# Altium schematic sheet HTBBMSALL4G.SchDoc
size 594 x 420 mm; SheetNumber: 1; SheetTotal: 1
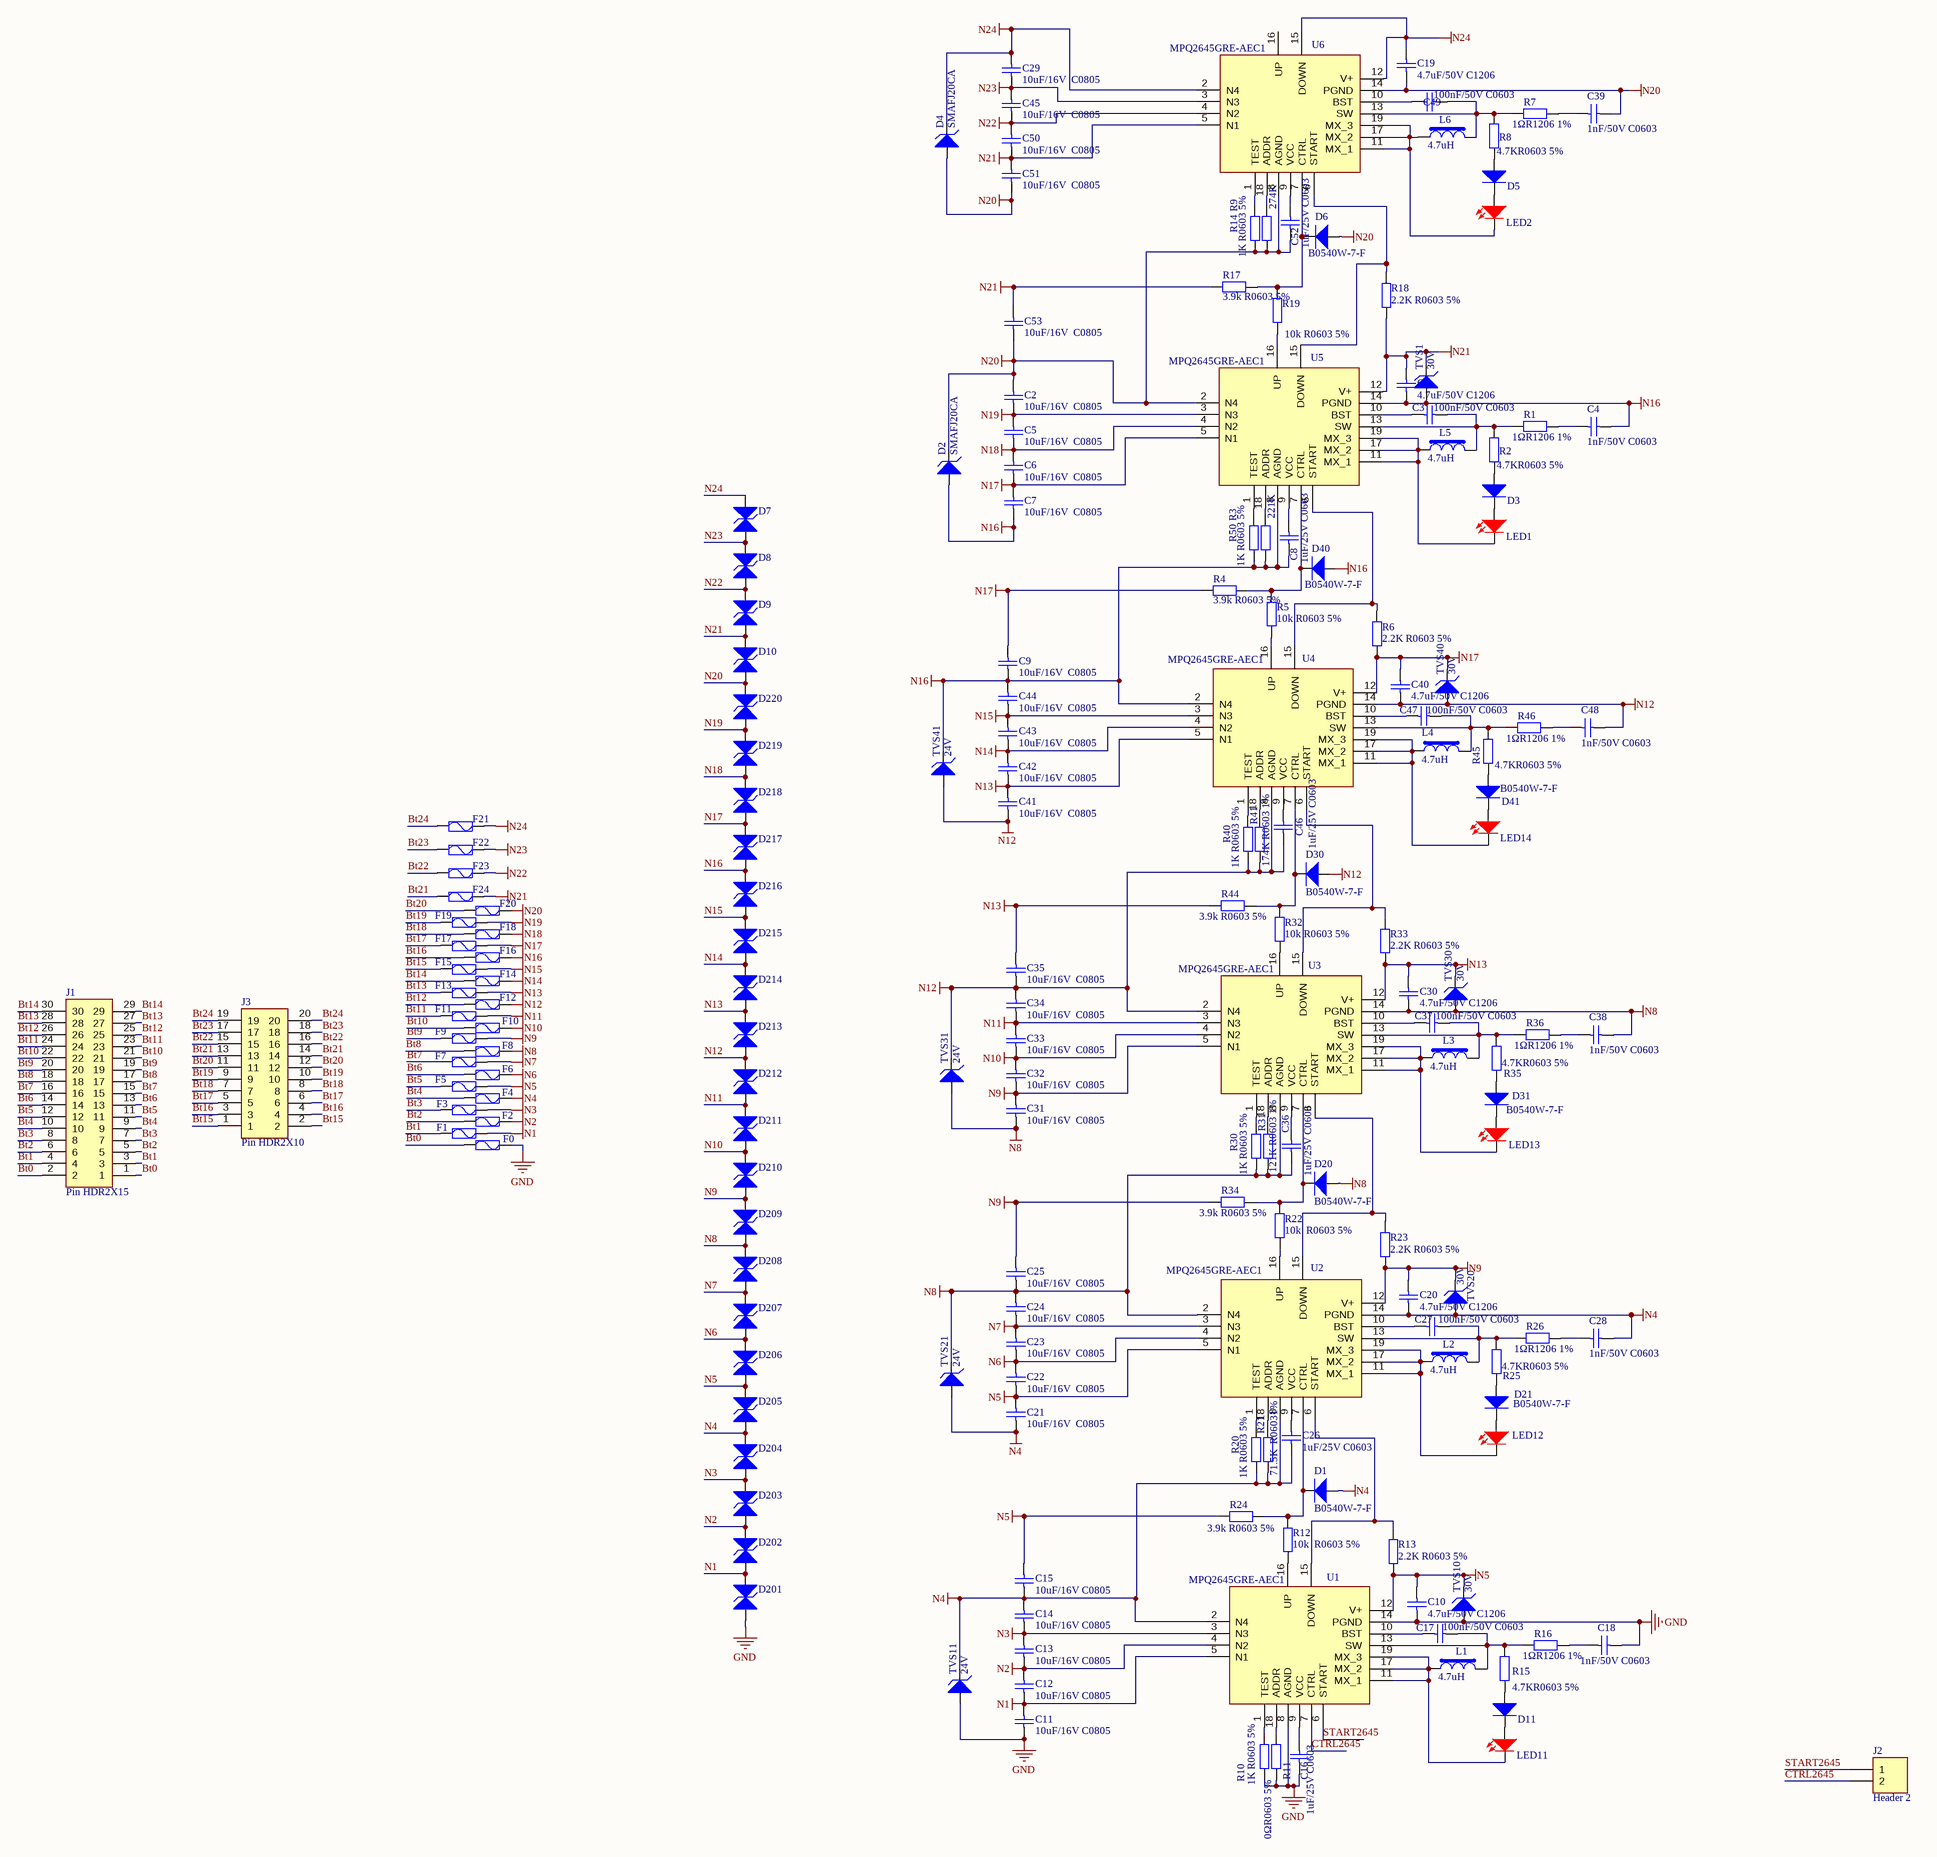
[diagram p0: HTBBMSALL4G.SchDoc]

## Parts
C1  4.7uF/50V C1206  [C1206]
C2  10uF/16V  C0805  [C0805]
C3  100nF/50V C0603  [C0603]
C4  1nF/50V C0603  [C0603]
C5  10uF/16V  C0805  [C0805]
C6  10uF/16V  C0805  [C0805]
C7  10uF/16V  C0805  [C0805]
C8  1uF/25V C0603  [C0603]
C9  10uF/16V  C0805  [C0805]
C10  4.7uF/50V C1206  [C1206]
C11  10uF/16V C0805  [C0805]
C12  10uF/16V C0805  [C0805]
C13  10uF/16V C0805  [C0805]
C14  10uF/16V C0805  [C0805]
C15  10uF/16V C0805  [C0805]
C16  1uF/25V C0603  [C0603]
C17  100nF/50V C0603  [C0603]
C18  1nF/50V C0603  [C0603]
C19  4.7uF/50V C1206  [C1206]
C20  4.7uF/50V C1206  [C1206]
C21  10uF/16V  C0805  [C0805]
C22  10uF/16V  C0805  [C0805]
C23  10uF/16V  C0805  [C0805]
C24  10uF/16V  C0805  [C0805]
C25  10uF/16V  C0805  [C0805]
C26  1uF/25V C0603  [C0603]
C27  100nF/50V C0603  [C0603]
C28  1nF/50V C0603  [C0603]
C29  10uF/16V  C0805  [C0805]
C30  4.7uF/50V C1206  [C1206]
C31  10uF/16V  C0805  [C0805]
C32  10uF/16V  C0805  [C0805]
C33  10uF/16V  C0805  [C0805]
C34  10uF/16V  C0805  [C0805]
C35  10uF/16V  C0805  [C0805]
C36  1uF/25V C0603  [C0603]
C37  100nF/50V C0603  [C0603]
C38  1nF/50V C0603  [C0603]
C39  1nF/50V C0603  [C0603]
C40  4.7uF/50V C1206  [C1206]
C41  10uF/16V  C0805  [C0805]
C42  10uF/16V  C0805  [C0805]
C43  10uF/16V  C0805  [C0805]
C44  10uF/16V  C0805  [C0805]
C45  10uF/16V  C0805  [C0805]
C46  1uF/25V C0603  [C0603]
C47  100nF/50V C0603  [C0603]
C48  1nF/50V C0603  [C0603]
C49  100nF/50V C0603  [C0603]
C50  10uF/16V  C0805  [C0805]
C51  10uF/16V  C0805  [C0805]
C52  1uF/25V C0603  [C0603]
C53  10uF/16V  C0805  [C0805]
D1  B0540W-7-F  [SOD-123FL]
D2  SMAFJ20CA  [SMAF/DO-214AD]
D3  B0540W-7-F  [SOD-123FL]  (value not drawn)
D4  SMAFJ20CA  [SMAF/DO-214AD]
D5  B0540W-7-F  [SOD-123FL]  (value not drawn)
D6  B0540W-7-F  [SOD-123FL]
D7  1N5819HW-7-F  [SOD-123FL]  (value not drawn)
D8  1N5819HW-7-F  [SOD-123FL]  (value not drawn)
D9  1N5819HW-7-F  [SOD-123FL]  (value not drawn)
D10  1N5819HW-7-F  [SOD-123FL]  (value not drawn)
D11  B0540W-7-F  [SOD-123FL]  (value not drawn)
D20  B0540W-7-F  [SOD-123FL]
D21  B0540W-7-F  [SOD-123FL]
D30  B0540W-7-F  [SOD-123FL]
D31  B0540W-7-F  [SOD-123FL]
D40  B0540W-7-F  [SOD-123FL]
D41  B0540W-7-F  [SOD-123FL]
D201  1N5819HW-7-F  [SOD-123FL]  (value not drawn)
D202  1N5819HW-7-F  [SOD-123FL]  (value not drawn)
D203  1N5819HW-7-F  [SOD-123FL]  (value not drawn)
D204  1N5819HW-7-F  [SOD-123FL]  (value not drawn)
D205  1N5819HW-7-F  [SOD-123FL]  (value not drawn)
D206  1N5819HW-7-F  [SOD-123FL]  (value not drawn)
D207  1N5819HW-7-F  [SOD-123FL]  (value not drawn)
D208  1N5819HW-7-F  [SOD-123FL]  (value not drawn)
D209  1N5819HW-7-F  [SOD-123FL]  (value not drawn)
D210  1N5819HW-7-F  [SOD-123FL]  (value not drawn)
D211  1N5819HW-7-F  [SOD-123FL]  (value not drawn)
D212  1N5819HW-7-F  [SOD-123FL]  (value not drawn)
D213  1N5819HW-7-F  [SOD-123FL]  (value not drawn)
D214  1N5819HW-7-F  [SOD-123FL]  (value not drawn)
D215  1N5819HW-7-F  [SOD-123FL]  (value not drawn)
D216  1N5819HW-7-F  [SOD-123FL]  (value not drawn)
D217  1N5819HW-7-F  [SOD-123FL]  (value not drawn)
D218  1N5819HW-7-F  [SOD-123FL]  (value not drawn)
D219  1N5819HW-7-F  [SOD-123FL]  (value not drawn)
D220  1N5819HW-7-F  [SOD-123FL]  (value not drawn)
F0  0458008.DR  [F1206]  (value not drawn)
F1  0458008.DR  [F1206]  (value not drawn)
F2  0458008.DR  [F1206]  (value not drawn)
F3  0458008.DR  [F1206]  (value not drawn)
F4  0458008.DR  [F1206]  (value not drawn)
F5  0458008.DR  [F1206]  (value not drawn)
F6  0458008.DR  [F1206]  (value not drawn)
F7  0458008.DR  [F1206]  (value not drawn)
F8  0458008.DR  [F1206]  (value not drawn)
F9  0458008.DR  [F1206]  (value not drawn)
F10  0458008.DR  [F1206]  (value not drawn)
F11  0458008.DR  [F1206]  (value not drawn)
F12  0458008.DR  [F1206]  (value not drawn)
F13  0458008.DR  [F1206]  (value not drawn)
F14  0458008.DR  [F1206]  (value not drawn)
F15  0458008.DR  [F1206]  (value not drawn)
F16  0458008.DR  [F1206]  (value not drawn)
F17  0458008.DR  [F1206]  (value not drawn)
F18  0458008.DR  [F1206]  (value not drawn)
F19  0458008.DR  [F1206]  (value not drawn)
F20  0458008.DR  [F1206]  (value not drawn)
F21  0458008.DR  [F1206]  (value not drawn)
F22  0458008.DR  [F1206]  (value not drawn)
F23  0458008.DR  [F1206]  (value not drawn)
F24  0458008.DR  [F1206]  (value not drawn)
J1  Pin HDR2X15  [PH2.0-15*2]
J2  Header 2  [HDR1X2]
J3  Pin HDR2X10  [PH2.0-10*2]
L1  4.7uH  [L7*6.6]
L2  4.7uH  [L7*6.6]
L3  4.7uH  [L7*6.6]
L4  4.7uH  [L7*6.6]
L5  4.7uH  [L7*6.6]
L6  4.7uH  [L7*6.6]
LED1  XL-1608SURC-06  [LED0603R]  (value not drawn)
LED2  XL-1608SURC-06  [LED0603R]  (value not drawn)
LED11  XL-1608SURC-06  [LED0603R]  (value not drawn)
LED12  XL-1608SURC-06  [LED0603R]  (value not drawn)
LED13  XL-1608SURC-06  [LED0603R]  (value not drawn)
LED14  XL-1608SURC-06  [LED0603R]  (value not drawn)
R1  1ΩR1206 1%  [1206]
R2  4.7KR0603 5%  [0603]
R3  221K  [0603]
R4  3.9k R0603 5%  [0603]
R5  10k R0603 5%  [0603]
R6  2.2K R0603 5%  [0603]
R7  1ΩR1206 1%  [1206]
R8  4.7KR0603 5%  [0603]
R9  274K  [0603]
R10  1K R0603 5%  [0603]
R11  0ΩR0603 5%  [0603]
R12  10k  R0603 5%  [0603]
R13  2.2K R0603 5%  [0603]
R14  1K R0603 5%  [0603]
R15  4.7KR0603 5%  [0603]
R16  1ΩR1206 1%  [1206]
R17  3.9k R0603 5%  [0603]
R18  2.2K R0603 5%  [0603]
R19  10k R0603 5%  [0603]
R20  1K R0603 5%  [0603]
R21  71.5K  R06031%  [0603]
R22  10k  R0603 5%  [0603]
R23  2.2K R0603 5%  [0603]
R24  3.9k R0603 5%  [0603]
R25  4.7KR0603 5%  [0603]
R26  1ΩR1206 1%  [1206]
R30  1K R0603 5%  [0603]
R31  121K R0603 1%  [0603]
R32  10k R0603 5%  [0603]
R33  2.2K R0603 5%  [0603]
R34  3.9k R0603 5%  [0603]
R35  4.7KR0603 5%  [0603]
R36  1ΩR1206 1%  [1206]
R40  1K R0603 5%  [0603]
R41  174K R0603 1%  [0603]
R44  3.9k R0603 5%  [0603]
R45  4.7KR0603 5%  [0603]
R46  1ΩR1206 1%  [1206]
R50  1K R0603 5%  [0603]
TVS1  30V  [SMAF/DO-214AD]
TVS10  30V  [SMAF/DO-214AD]
TVS11  24V  [SMAF/DO-214AD]
TVS20  30V  [SMAF/DO-214AD]
TVS21  24V  [SMAF/DO-214AD]
TVS30  30V  [SMAF/DO-214AD]
TVS31  24V  [SMAF/DO-214AD]
TVS40  30V  [SMAF/DO-214AD]
TVS41  24V  [SMAF/DO-214AD]
U1  MPQ2645GRE-AEC1  [QFN19_4x4]
U2  MPQ2645GRE-AEC1  [QFN19_4x4]
U3  MPQ2645GRE-AEC1  [QFN19_4x4]
U4  MPQ2645GRE-AEC1  [QFN19_4x4]
U5  MPQ2645GRE-AEC1  [QFN19_4x4]
U6  MPQ2645GRE-AEC1  [QFN19_4x4]

## Nets
GND: C10.1 C11.1 C16.1 C18.1 D201.1(A) F0.2 R10.2 R11.2 TVS10.1(A) TVS11.1(A) U1.8(AGND) U1.14(PGND)
N1: C11.2 C12.1 D201.2(K) D202.1(A) F1.2 U1.5(N1)
N2: C12.2 C13.1 D202.2(K) D203.1(A) F2.2 U1.4(N2)
N3: C13.2 C14.1 D203.2(K) D204.1(A) F3.2 U1.3(N3)
N4: C14.2 C15.1 C20.1 C21.1 C26.1 C28.1 D1.1(A) D204.2(K) D205.1(A) F4.2 R20.2 R21.2 TVS11.2(K) TVS20.1(A) TVS21.1(A) U1.2(N4) U2.8(AGND) U2.14(PGND)
N5: C10.2 C15.2 C21.2 C22.1 D205.2(K) D206.1(A) F5.2 R13.1 R24.2 TVS10.2(K) U1.12(V+) U2.5(N1)
N6: C22.2 C23.1 D206.2(K) D207.1(A) F6.2 U2.4(N2)
N7: C23.2 C24.1 D207.2(K) D208.1(A) F7.2 U2.3(N3)
N8: C24.2 C25.1 C30.1 C31.1 C36.1 C38.1 D20.1(A) D208.2(K) D209.1(A) F8.2 R30.2 R31.2 TVS21.2(K) TVS30.1(A) TVS31.1(A) U2.2(N4) U3.8(AGND) U3.14(PGND)
N9: C20.2 C25.2 C31.2 C32.1 D209.2(K) D210.1(A) F9.2 R23.1 R34.2 TVS20.2(K) U2.12(V+) U3.5(N1)
N10: C32.2 C33.1 D210.2(K) D211.1(A) F10.2 U3.4(N2)
N11: C33.2 C34.1 D211.2(K) D212.1(A) F11.2 U3.3(N3)
N12: C34.2 C35.1 C40.1 C41.1 C46.1 C48.1 D30.1(A) D212.2(K) D213.1(A) F12.2 R40.2 R41.2 TVS31.2(K) TVS40.1(A) TVS41.1(A) U3.2(N4) U4.8(AGND) U4.14(PGND)
N13: C30.2 C35.2 C41.2 C42.1 D213.2(K) D214.1(A) F13.2 R33.1 R44.2 TVS30.2(K) U3.12(V+) U4.5(N1)
N14: C42.2 C43.1 D214.2(K) D215.1(A) F14.2 U4.4(N2)
N15: C43.2 C44.1 D215.2(K) D216.1(A) F15.2 U4.3(N3)
N16: C1.1 C4.1 C7.1 C8.1 C9.1 C44.2 D2.1(A) D40.1(A) D216.2(K) D217.1(A) F16.2 R3.2 R50.2 TVS1.1(A) TVS41.2(K) U4.2(N4) U5.8(AGND) U5.14(PGND)
N17: C6.1 C7.2 C9.2 C40.2 D217.2(K) D218.1(A) F17.2 R4.2 R6.1 TVS40.2(K) U4.12(V+) U5.5(N1)
N18: C5.1 C6.2 D218.2(K) D219.1(A) F18.2 U5.4(N2)
N19: C2.1 C5.2 D219.2(K) D220.1(A) F19.2 U5.3(N3)
N20: C2.2 C19.1 C39.1 C51.1 C52.1 C53.1 D2.2(K) D4.1(A) D6.1(A) D10.1(A) D220.2(K) F20.2 R9.2 R14.2 U5.2(N4) U6.8(AGND) U6.14(PGND)
N21: C1.2 C50.1 C51.2 C53.2 D9.1(A) D10.2(K) F24.2 R17.2 R18.1 TVS1.2(K) U5.12(V+) U6.5(N1)
N22: C45.1 C50.2 D8.1(A) D9.2(K) F23.2 U6.4(N2)
N23: C29.1 C45.2 D7.1(A) D8.2(K) F22.2 U6.3(N3)
N24: C19.2 C29.2 D4.2(K) D7.2(K) F21.2 U6.2(N4) U6.12(V+) U6.15(DOWN)
Bt0: F0.1 J1.1 J1.2
Bt1: F1.1 J1.3 J1.4
Bt2: F2.1 J1.5 J1.6
Bt3: F3.1 J1.7 J1.8
Bt4: F4.1 J1.9 J1.10
Bt5: F5.1 J1.11 J1.12
Bt6: F6.1 J1.13 J1.14
Bt7: F7.1 J1.15 J1.16
Bt8: F8.1 J1.17 J1.18
Bt9: F9.1 J1.19 J1.20
Bt10: F10.1 J1.21 J1.22
Bt11: F11.1 J1.23 J1.24
Bt12: F12.1 J1.25 J1.26
Bt13: F13.1 J1.27 J1.28
Bt14: F14.1 J1.29 J1.30
Bt15: F15.1 J3.1 J3.2
Bt16: F16.1 J3.3 J3.4
Bt17: F17.1 J3.5 J3.6
Bt18: F18.1 J3.7 J3.8
Bt19: F19.1 J3.9 J3.10
Bt20: F20.1 J3.11 J3.12
Bt21: F24.1 J3.13 J3.14
Bt22: F23.1 J3.15 J3.16
Bt23: F22.1 J3.17 J3.18
Bt24: F21.1 J3.19 J3.20
CTRL2645: J2.2 U1.7(CTRL)
START2645: J2.1 U1.6(START)
NetC3_1: C3.1 L5.2 R1.2 R2.1 U5.13(SW)
NetC3_2: C3.2 U5.10(BST)
NetC4_2: C4.2 R1.1
NetC8_2: C8.2 U5.9(VCC)
NetC16_2: C16.2 U1.9(VCC)
NetC17_1: C17.1 L1.2 R15.1 R16.2 U1.13(SW)
NetC17_2: C17.2 U1.10(BST)
NetC18_2: C18.2 R16.1
NetC26_2: C26.2 U2.9(VCC)
NetC27_1: C27.1 L2.2 R25.1 R26.2 U2.13(SW)
NetC27_2: C27.2 U2.10(BST)
NetC28_2: C28.2 R26.1
NetC36_2: C36.2 U3.9(VCC)
NetC37_1: C37.1 L3.2 R35.1 R36.2 U3.13(SW)
NetC37_2: C37.2 U3.10(BST)
NetC38_2: C38.2 R36.1
NetC39_2: C39.2 R7.1
NetC46_2: C46.2 U4.9(VCC)
NetC47_1: C47.1 L4.2 R45.1 R46.2 U4.13(SW)
NetC47_2: C47.2 U4.10(BST)
NetC48_2: C48.2 R46.1
NetC49_1: C49.1 L6.2 R7.2 R8.1 U6.13(SW)
NetC49_2: C49.2 U6.10(BST)
NetC52_2: C52.2 U6.9(VCC)
NetD1_2: D1.2(K) R12.1 R24.1 U2.7(CTRL)
NetD3_1: D3.1(A) R2.2
NetD3_2: D3.2(K) LED1.1(A)
NetD5_1: D5.1(A) R8.2
NetD5_2: D5.2(K) LED2.1(A)
NetD6_2: D6.2(K) R17.1 R19.1 U6.7(CTRL)
NetD11_1: D11.1(A) R15.2
NetD11_2: D11.2(K) LED11.1(A)
NetD20_2: D20.2(K) R22.1 R34.1 U3.7(CTRL)
NetD21_1: D21.1(A) R25.2
NetD21_2: D21.2(K) LED12.1(A)
NetD30_2: D30.2(K) R32.1 R44.1 U4.7(CTRL)
NetD31_1: D31.1(A) R35.2
NetD31_2: D31.2(K) LED13.1(A)
NetD40_2: D40.2(K) R4.1 R5.1 U5.7(CTRL)
NetD41_1: D41.1(A) R45.2
NetD41_2: D41.2(K) LED14.1(A)
NetL1_1: L1.1 LED11.2(K) U1.11(MX_1) U1.17(MX_2) U1.19(MX_3)
NetL2_1: L2.1 LED12.2(K) U2.11(MX_1) U2.17(MX_2) U2.19(MX_3)
NetL3_1: L3.1 LED13.2(K) U3.11(MX_1) U3.17(MX_2) U3.19(MX_3)
NetL4_1: L4.1 LED14.2(K) U4.11(MX_1) U4.17(MX_2) U4.19(MX_3)
NetL5_1: L5.1 LED1.2(K) U5.11(MX_1) U5.17(MX_2) U5.19(MX_3)
NetL6_1: L6.1 LED2.2(K) U6.11(MX_1) U6.17(MX_2) U6.19(MX_3)
NetR3_1: R3.1 U5.18(ADDR)
NetR5_2: R5.2 U4.16(UP)
NetR6_2: R6.2 U4.15(DOWN) U5.6(START)
NetR9_1: R9.1 U6.18(ADDR)
NetR10_1: R10.1 U1.1(TEST)
NetR11_1: R11.1 U1.18(ADDR)
NetR12_2: R12.2 U1.16(UP)
NetR13_2: R13.2 U1.15(DOWN) U2.6(START)
NetR14_1: R14.1 U6.1(TEST)
NetR18_2: R18.2 U5.15(DOWN) U6.6(START)
NetR19_2: R19.2 U5.16(UP)
NetR20_1: R20.1 U2.1(TEST)
NetR21_1: R21.1 U2.18(ADDR)
NetR22_2: R22.2 U2.16(UP)
NetR23_2: R23.2 U2.15(DOWN) U3.6(START)
NetR30_1: R30.1 U3.1(TEST)
NetR31_1: R31.1 U3.18(ADDR)
NetR32_2: R32.2 U3.16(UP)
NetR33_2: R33.2 U3.15(DOWN) U4.6(START)
NetR40_1: R40.1 U4.1(TEST)
NetR41_1: R41.1 U4.18(ADDR)
NetR50_1: R50.1 U5.1(TEST)

Not connected (* = marked no-connect by the designer): U6 16(UP)

## Notes on the sheet
- DWG NO:
- REV:
- THIS DOCUMENT AND THE DATA DISCLOSED HEREIN OR
- HEREWITH IS THE PROPERTY OF ALTIUM LIMITED AND MAY
- BE FREELY DISTRIBUTED IN WHOLE. NO RIGHTS ARE
- RESERVED OR EXPRESS OR IMPLIED WARANTEE GIVEN.
- REVISION
- DESCRIPTION
- DATE
- APPROVED
- ENG:
- APPROVALS
- PROJECT
- DSN:
- CHK:
- REFERENCE DOCUMENTS
- PROJECT REVISION:
- TITLE
- DOCUMENT REVISION:
- DESIGN ITEM:
- BOM:
- FAB DWG:
- PCB DWG:
- ASSY DWG:
- SCALE:
- A2
- SIZE
- CAGE CODE
- FILE NAME
- DWG NO.
- SHEET
- OF
- REV

## Library data of the parts
C1-C53 = Cap: Capacitor
D1 D3 D5 D6 D11 D20 D21 D30 D31 D40 D41 = Diode
D2 D4 TVS1 TVS10 TVS11 TVS20 TVS21 TVS30 TVS31 TVS40 TVS41 = D UTVS: Uniderection TVS Diode
D7-D10 D201-D220 = D TVS: TVS Diode, bidirectional
F0-F24 = Fuse: Published: 8-Jun-2000; LatestRevisionDate: 17-Jul-2002; LatestRevisionNote: Re-released for DXP Platform.; PackageReference: PIN-W2/E2.8; Publisher: Altium Limited
J2 = Header 2: Header, 2-Pin; LatestRevisionDate: 17-Jul-2002; LatestRevisionNote: Re-released for DXP Platform.; Publisher: Altium Limited
L1-L6 = Inductor2: Inductor Iron
LED1 LED2 LED11-LED14 = LEDR: Red LED
R1-R26 R30-R36 R40 R41 R44-R46 R50 = Res2: Resistor
U1-U6 = 2645